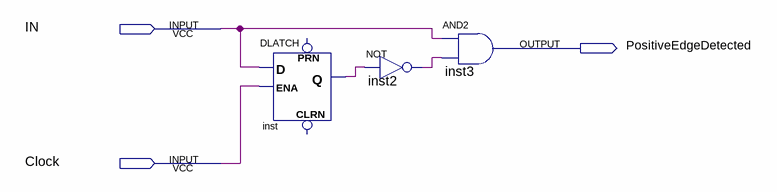
[diagram p0: schematic sheet]
// Quartus schematic EdgeDetector.bdf as structural Verilog: 3 symbols, 3 pins
module EdgeDetector (
  input  IN,
  input  Clock,
  output PositiveEdgeDetected
);

  wire inst2_out, inst_q;

  DLATCH inst (.D(IN), .ENA(Clock), .Q(inst_q));  // open: CLRN, PRN
  not inst2 (inst2_out, inst_q);
  and inst3 (PositiveEdgeDetected, IN, inst2_out);
endmodule
